# Altium schematic sheet peripherals.SchDoc: peripherals
size A3; DocumentNumber: MB1144; Revision: C-02; SheetNumber: 15; SheetTotal: 25; PageSetup: Record=PageOptions|CenterHorizontal=True|CenterVertical=True|PrintScale=1.39|XCorrection=1.00|YCorrection=1.00|PrintKind=1|BorderSize=5000000|LeftOffset=0|BottomOffset=0|Orientation=2|PaperLength=1000|PaperWidth=1000|Scale=100|PaperSource=264|PrintQuality=600|MediaType=1|DitherType=10|PaperKind=A3|PrintScaleMode=1; Project: STM32L476G-EVAL; ModifiedDate: 9/23/2015
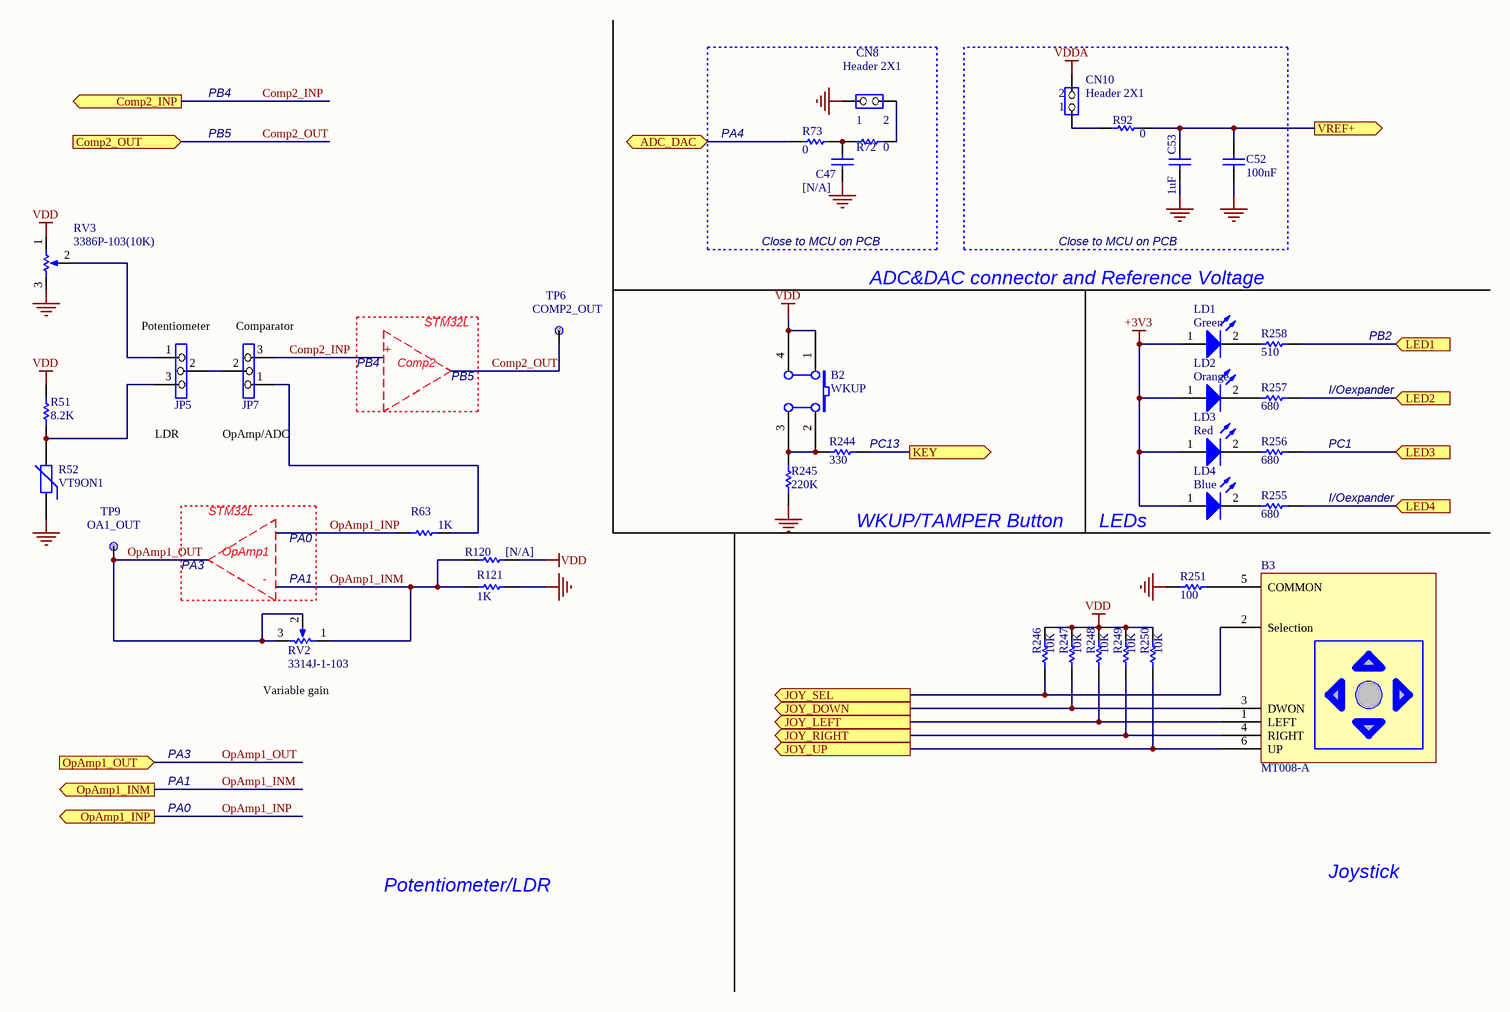
[diagram p0: peripherals.SchDoc]

## Parts
B2  WKUP  [PB10]
B3  MT008-A  [MT-008A]
C47  [N/A]  [0603C]
C52  100nF  [0402C]
C53  1uF  [0603C]
CN8  Header 2X1  [SIP2]
CN10  Header 2X1  [SIP2]
JP5  Header 3X1  [SIP3]  (value not drawn)
JP7  Header 3X1  [SIP3]  (value not drawn)
LD1  Green  [0603D]
LD2  Orange  [0603D]
LD3  Red  [0603D]
LD4  Blue  [0603D]
R51  8.2K  [0402R]
R52  VT9ON1  [PVT901]
R63  1K  [0402R]
R72  0  [0603R]
R73  0  [0603R]
R92  0  [0603R]
R120  [N/A]  [0603R]
R121  1K  [0402R]
R244  330  [0402R]
R245  220K  [0402R]
R246  10K  [0402R]
R247  10K  [0402R]
R248  10K  [0402R]
R249  10K  [0402R]
R250  10K  [0402R]
R251  100  [0402R]
R255  680  [0402R]
R256  680  [0402R]
R257  680  [0402R]
R258  510  [0402R]
RV2  3314J-1-103  [PTF_3314J]
RV3  3386P-103(10K)  [3386P]
TP6  TP Name: COMP2_OUT  [TP]  (hidden comment: [N/A])
TP9  TP Name: OA1_OUT  [TP]  (hidden comment: [N/A])

## Ports
ADC_DAC (bidir), Comp2_INP (out), Comp2_OUT (in), JOY_DOWN (out), JOY_LEFT (out), JOY_RIGHT (out), JOY_SEL (out), JOY_UP (out), KEY (out), LED1 (in), LED2 (in), LED3 (in), LED4 (in), OpAmp1_INM (out), OpAmp1_INP (out), OpAmp1_OUT (in), VREF+ (out)

## Nets
+3V3: LD1.1(A) LD2.1(A) LD3.1(A) LD4.1(A)
GND: C47.1 C52.1 C53.2 CN8.1(COMMON) R52.1 R121.1 R245.2 R251.1 RV3.3(TOP)
VDD: B2.1(A0) B2.4(A1) R51.2 R120.2 R246.1 R247.2 R248.2 R249.2 R250.2 RV3.1(BOT)
VDDA: CN10.2(NO)
ADC_DAC: R73.1 ; port ADC_DAC
Comp2_INP: JP7.3 ; port Comp2_INP
Comp2_OUT: TP6.1 ; port Comp2_OUT
JOY_DOWN: B3.3(DWON) R247.1 ; port JOY_DOWN
JOY_LEFT: B3.1(LEFT) R248.1 ; port JOY_LEFT
JOY_RIGHT: B3.4(RIGHT) R249.1 ; port JOY_RIGHT
JOY_SEL: B3.2(Selection) R246.2 ; port JOY_SEL
JOY_UP: B3.6(UP) R250.1 ; port JOY_UP
KEY: R244.2 ; port KEY
LED1: R258.1 ; port LED1
LED2: R257.1 ; port LED2
LED3: R256.1 ; port LED3
LED4: R255.1 ; port LED4
OpAmp1_INM: R120.1 R121.2 RV2.1(BOT) ; port OpAmp1_INM
OpAmp1_INP: R63.2 ; port OpAmp1_INP
OpAmp1_OUT: RV2.2(TAP) RV2.3(TOP) TP9.1 ; port OpAmp1_OUT
VREF+: C52.2 C53.1 R92.2 ; port VREF+
NetB2_2: B2.2(B0) B2.3(B1) R244.1 R245.1
NetB3_5: B3.5(COMMON) R251.2
NetC47_2: C47.2 R72.1 R73.2
NetCN8_2: CN8.2(NO) R72.2
NetCN10_1: CN10.1(COMMON) R92.1
NetJP5_1: JP5.1 RV3.2(TAP)
NetJP5_2: JP5.2 JP7.2
NetJP5_3: JP5.3 R51.1 R52.2
NetJP7_1: JP7.1 R63.1
NetLD1_2: LD1.2(K) R258.2
NetLD2_2: LD2.2(K) R257.2
NetLD3_2: LD3.2(K) R256.2
NetLD4_2: LD4.2(K) R255.2

## Notes on the sheet
- PB4
- (near CN10) 2
- PB5
- PA4
- 1
- 2
- (near CN10) 1
- Close to MCU on PCB
- ADC&DAC connector and Reference Voltage
- Potentiometer
- (near JP7) Comparator
- +
- Comp2
- STM32L
- PB2
- LDR
- OpAmp/ADC
- I/Oexpander
- (near R244) PC13
- PC1
- PA3
- OpAmp1
- PA0
- WKUP/TAMPER Button
- LEDs
- (near RV2) -
- (near RV2) PA1
- (near RV2) Variable gain
- PA1
- Potentiometer/LDR
- Joystick
- Title:
- Project:
- Size:
- Date:
- A3
- Reference:
- Sheet:
- Revision:
- of

## Library data of the parts
B2 = SW PUSHBUTTON: SE PUSHBUTTON; Ordered by: Subcon; Assembly: Blue; ECCN_US/EU: NA
B3 = MT-008A: Ordered by: Subcon; Assembly: with button; ECCN_US/EU: NA
C47 = cap: Capacitor; Value: 100pF; Ordered by: Subcon; ECCN_US/EU: NA; Fitted: NO; Published: 8-Jun-2000; Revision: July-2002: Re-released for DXP Platform.; Publisher: Altium Limited
C52 = Cap: Capacitor; Value: 10nF; Ordered by: Subcon; ECCN_US/EU: NA; Published: 8-Jun-2000; Revision: July-2002: Re-released for DXP Platform.; Publisher: Altium Limited
C53 = CAP: Capacitor; Value: 100nF; Ordered by: Subcon; ECCN_US/EU: NA; Published: 8-Jun-2000; Revision: July-2002: Re-released for DXP Platform.; Publisher: Altium Limited
CN8 CN10 = JP2: Ordered by: Subcon; ECCN_US/EU: NA
JP5 JP7 = Jumper3: Ordered by: Subcon; ECCN_US/EU: NA
LD1-LD4 = LED2: Typical RED, GREEN, YELLOW, AMBER GaAs LED; Ordered by: Subcon; ECCN_US/EU: NA; Published: 8-Jun-2000; Revision: July-2002: Re-released for DXP Platform.; Publisher: Altium Limited
R51 R72 R73 R92 R244 R246-R251 R255-R258 = Res1: Resistor; Value: 1K; Ordered by: Subcon; ECCN_US/EU: NA; Published: 8-Jun-2000; Revision: July-2002: Re-released for DXP Platform.; Publisher: Altium Limited
R52 = Res Varistor: Varistor (Voltage-Sensitive Resistor); ECCN_US/EU: NA; Ordered by: Subcon; Published: 24-Mar-1999; Revision: July-2002: Re-released for DXP Platform.; Publisher: Altium Limited
R63 R121 = Res1: Resistor; Ordered by: Subcon; ECCN_US/EU: NA; Published: 8-Jun-2000; Revision: July-2002: Re-released for DXP Platform.; Publisher: Altium Limited; Value: 1K
R120 = Res1: Resistor; Value: 1K; Ordered by: Subcon; ECCN_US/EU: NA; Fitted: NO; Published: 8-Jun-2000; Revision: July-2002: Re-released for DXP Platform.; Publisher: Altium Limited
R245 = res1: Resistor; Value: 1K; Ordered by: Subcon; ECCN_US/EU: NA; Published: 8-Jun-2000; Revision: July-2002: Re-released for DXP Platform.; Publisher: Altium Limited
RV2 = RV: Potentiometer 10K; Ordered by: Subcon; Comments: adjustable 10K potentiometer; ECCN_US/EU: NA
RV3 = RV: Potentiometer 10K; Ordered by: Subcon; Comments: 10K potentiometer; ECCN_US/EU: NA
TP6 TP9 = TP: Ordered by: Subcon; Fitted or not fitted: NO; ECCN_US/EU: NA; Fitted: NO